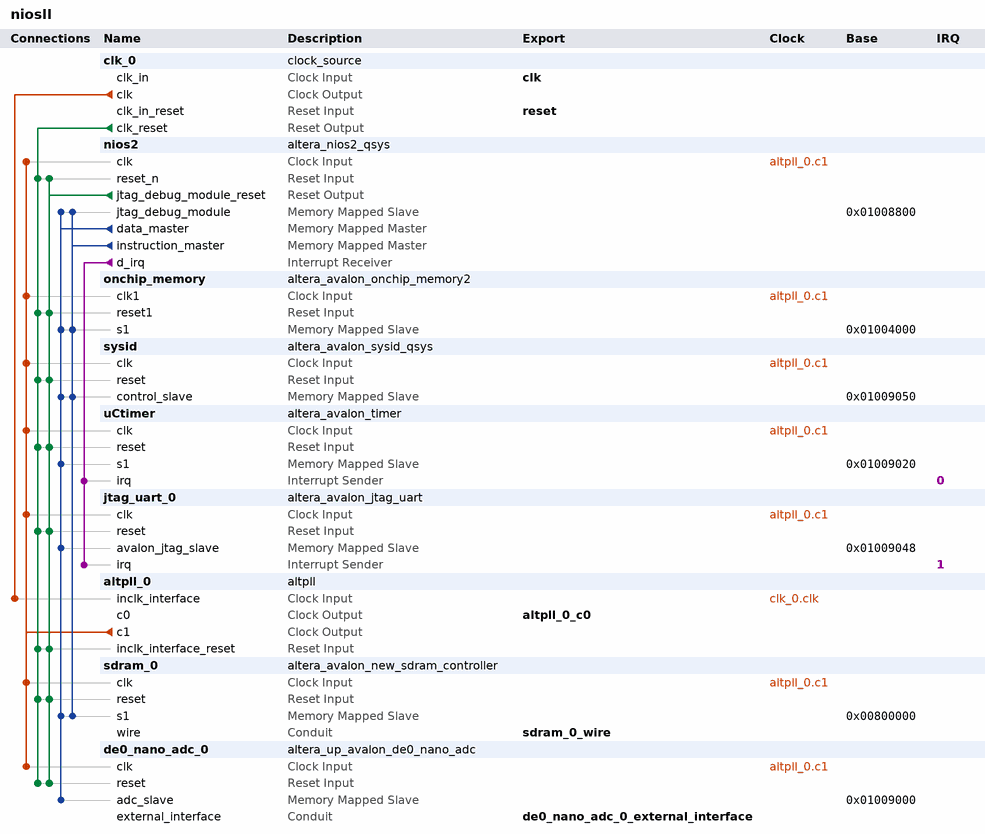
[diagram p0: system contents]
# Platform Designer (Qsys) system niosII, Cyclone IV E EP4CE22F17C6
# Parameters at their usual value, and those the tool derives, are not listed.
package require -exact qsys 12.1
create_system niosII
set_project_property DEVICE_FAMILY {Cyclone IV E}
set_project_property DEVICE EP4CE22F17C6

add_instance clk_0 clock_source 12.1
set_instance_parameter_value clk_0 clockFrequency 50000000

add_instance nios2 altera_nios2_qsys 12.1
set_instance_parameter_value nios2 resetSlave sdram_0.s1
set_instance_parameter_value nios2 exceptionSlave sdram_0.s1
set_instance_parameter_value nios2 breakSlave nios2.jtag_debug_module
set_instance_parameter_value nios2 impl Tiny
set_instance_parameter_value nios2 icache_size 4096

add_instance onchip_memory altera_avalon_onchip_memory2 12.1
set_instance_parameter_value onchip_memory dataWidth 32
set_instance_parameter_value onchip_memory dualPort false
set_instance_parameter_value onchip_memory initMemContent true
set_instance_parameter_value onchip_memory initializationFileName onchip_memory
set_instance_parameter_value onchip_memory memorySize 16384

add_instance sysid altera_avalon_sysid_qsys 12.1
set_instance_parameter_value sysid id 0

add_instance uCtimer altera_avalon_timer 12.1
set_instance_parameter_value uCtimer period 1
set_instance_parameter_value uCtimer periodUnits MSEC
set_instance_parameter_value uCtimer timerPreset CUSTOM

add_instance jtag_uart_0 altera_avalon_jtag_uart 12.1
set_instance_parameter_value jtag_uart_0 simInteractiveOptions INTERACTIVE_ASCII_OUTPUT

add_instance altpll_0 altpll 12.1
set_instance_parameter_value altpll_0 INCLK0_INPUT_FREQUENCY 20000
set_instance_parameter_value altpll_0 CLK0_MULTIPLY_BY 1
set_instance_parameter_value altpll_0 CLK1_MULTIPLY_BY 1
set_instance_parameter_value altpll_0 CLK0_DIVIDE_BY 1
set_instance_parameter_value altpll_0 CLK1_DIVIDE_BY 1
set_instance_parameter_value altpll_0 CLK0_PHASE_SHIFT -3000
set_instance_parameter_value altpll_0 CLK1_PHASE_SHIFT 0
set_instance_parameter_value altpll_0 CLK1_DUTY_CYCLE 50
set_instance_parameter_value altpll_0 PORT_clk1 PORT_USED
set_instance_parameter_value altpll_0 PORT_clk2 PORT_UNUSED
set_instance_parameter_value altpll_0 PORT_clk3 PORT_UNUSED
set_instance_parameter_value altpll_0 PORT_ARESET PORT_UNUSED
set_instance_parameter_value altpll_0 PORT_LOCKED PORT_UNUSED

add_instance sdram_0 altera_avalon_new_sdram_controller 12.1
set_instance_parameter_value sdram_0 TAC 5.5
set_instance_parameter_value sdram_0 TRCD 20.0
set_instance_parameter_value sdram_0 TRP 20.0
set_instance_parameter_value sdram_0 casLatency 3
set_instance_parameter_value sdram_0 columnWidth 8
set_instance_parameter_value sdram_0 dataWidth 16
set_instance_parameter_value sdram_0 generateSimulationModel false
set_instance_parameter_value sdram_0 model custom
set_instance_parameter_value sdram_0 numberOfBanks 4
set_instance_parameter_value sdram_0 numberOfChipSelects 1
set_instance_parameter_value sdram_0 powerUpDelay 100.0
set_instance_parameter_value sdram_0 refreshPeriod 15.625
set_instance_parameter_value sdram_0 rowWidth 12

add_instance de0_nano_adc_0 altera_up_avalon_de0_nano_adc 12.0
set_instance_parameter_value de0_nano_adc_0 sclk_freq 3.2
set_instance_parameter_value de0_nano_adc_0 numch 8

# connections
add_connection altpll_0.c1 de0_nano_adc_0.clk clock
add_connection altpll_0.c1 jtag_uart_0.clk clock
add_connection altpll_0.c1 nios2.clk clock
add_connection altpll_0.c1 onchip_memory.clk1 clock
add_connection altpll_0.c1 sdram_0.clk clock
add_connection altpll_0.c1 sysid.clk clock
add_connection altpll_0.c1 uCtimer.clk clock
add_connection clk_0.clk altpll_0.inclk_interface clock
add_connection clk_0.clk_reset altpll_0.inclk_interface_reset reset
add_connection clk_0.clk_reset de0_nano_adc_0.reset reset
add_connection clk_0.clk_reset jtag_uart_0.reset reset
add_connection clk_0.clk_reset nios2.reset_n reset
add_connection clk_0.clk_reset onchip_memory.reset1 reset
add_connection clk_0.clk_reset sdram_0.reset reset
add_connection clk_0.clk_reset sysid.reset reset
add_connection clk_0.clk_reset uCtimer.reset reset
add_connection nios2.jtag_debug_module_reset altpll_0.inclk_interface_reset reset
add_connection nios2.jtag_debug_module_reset de0_nano_adc_0.reset reset
add_connection nios2.jtag_debug_module_reset jtag_uart_0.reset reset
add_connection nios2.jtag_debug_module_reset nios2.reset_n reset
add_connection nios2.jtag_debug_module_reset onchip_memory.reset1 reset
add_connection nios2.jtag_debug_module_reset sdram_0.reset reset
add_connection nios2.jtag_debug_module_reset sysid.reset reset
add_connection nios2.jtag_debug_module_reset uCtimer.reset reset
add_connection nios2.data_master de0_nano_adc_0.adc_slave avalon
set_connection_parameter_value nios2.data_master/de0_nano_adc_0.adc_slave baseAddress 0x01009000
add_connection nios2.data_master jtag_uart_0.avalon_jtag_slave avalon
set_connection_parameter_value nios2.data_master/jtag_uart_0.avalon_jtag_slave baseAddress 0x01009048
add_connection nios2.data_master nios2.jtag_debug_module avalon
set_connection_parameter_value nios2.data_master/nios2.jtag_debug_module baseAddress 0x01008800
add_connection nios2.data_master onchip_memory.s1 avalon
set_connection_parameter_value nios2.data_master/onchip_memory.s1 baseAddress 0x01004000
add_connection nios2.data_master sdram_0.s1 avalon
set_connection_parameter_value nios2.data_master/sdram_0.s1 baseAddress 0x00800000
add_connection nios2.data_master sysid.control_slave avalon
set_connection_parameter_value nios2.data_master/sysid.control_slave baseAddress 0x01009050
add_connection nios2.data_master uCtimer.s1 avalon
set_connection_parameter_value nios2.data_master/uCtimer.s1 baseAddress 0x01009020
add_connection nios2.instruction_master nios2.jtag_debug_module avalon
set_connection_parameter_value nios2.instruction_master/nios2.jtag_debug_module baseAddress 0x01008800
add_connection nios2.instruction_master onchip_memory.s1 avalon
set_connection_parameter_value nios2.instruction_master/onchip_memory.s1 baseAddress 0x01004000
add_connection nios2.instruction_master sdram_0.s1 avalon
set_connection_parameter_value nios2.instruction_master/sdram_0.s1 baseAddress 0x00800000
add_connection nios2.instruction_master sysid.control_slave avalon
set_connection_parameter_value nios2.instruction_master/sysid.control_slave baseAddress 0x01009050
add_connection nios2.d_irq jtag_uart_0.irq interrupt
set_connection_parameter_value nios2.d_irq/jtag_uart_0.irq irqNumber 1
add_connection nios2.d_irq uCtimer.irq interrupt
set_connection_parameter_value nios2.d_irq/uCtimer.irq irqNumber 0

# exported interfaces
add_interface clk clock sink
set_interface_property clk EXPORT_OF clk_0.clk_in
add_interface reset reset sink
set_interface_property reset EXPORT_OF clk_0.clk_in_reset
add_interface de0_nano_adc_0_external_interface conduit end
set_interface_property de0_nano_adc_0_external_interface EXPORT_OF de0_nano_adc_0.external_interface
add_interface sdram_0_wire conduit end
set_interface_property sdram_0_wire EXPORT_OF sdram_0.wire
add_interface altpll_0_c0 clock source
set_interface_property altpll_0_c0 EXPORT_OF altpll_0.c0

save_system niosII.qsys
